# Altium schematic sheet PowerMonitor.SchDoc
size Letter; SheetNumber: 5; SheetTotal: 5
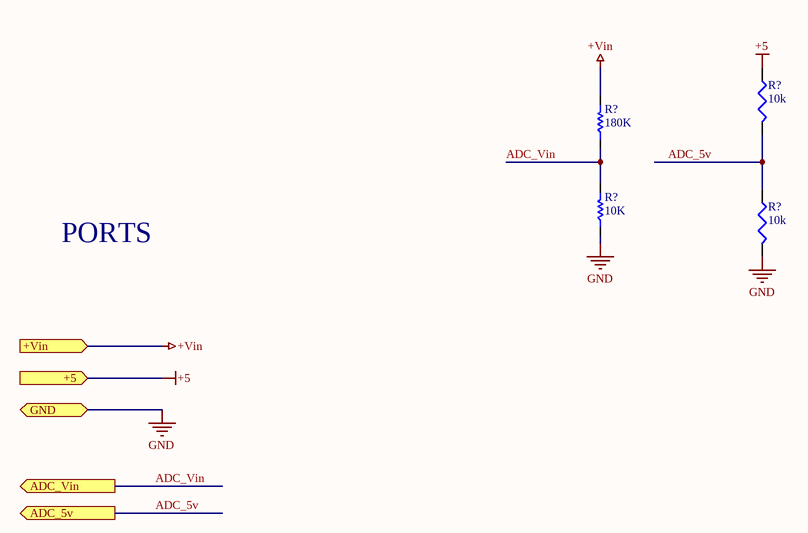
[diagram p0: PowerMonitor.SchDoc]

## Parts
(Parts that share a designator on the sheet are numbered #1, #2 ... from top to bottom, then left to right.)
R?#1  value 10k  [J1-0603]  (hidden comment: RC0603FR-0710KL)
R?#2  180K  [RES 0603 (1608X06L)]
R?#3  value 10k  [J1-0603]  (hidden comment: RC0603FR-0710KL)
R?#4  10K  [RES 0603 (1608X06L)]

## Ports
+5 (in), +Vin (in), ADC_5v (out), ADC_Vin (out), GND (bidir)

## Nets
+5: R?#1.1 ; port +5
+Vin: R?#2.2 ; port +Vin
GND: R?#3.2 R?#4.1 ; port GND
ADC_5v: R?#1.2 R?#3.1 ; port ADC_5v
ADC_Vin: R?#2.1 R?#4.2 ; port ADC_Vin

## Notes on the sheet
- PORTS

## Library data of the parts
R?#1 R?#3 = RC0603FR-0710KL: 10 kOhms 1 0.1 W 1 10 W Chip Resistor 0603 1608 Metric Thick Film; Pacage Metric: 1608; MF: Yageo or NXP; MP: 10K 1% 0603; ChipDip_Link: https://www.chipdip.ru/product0/9000079736; HelpURL: https://www.chipdip.ru/product0/9000079736; Package: R0603; Type: SMD; SnapEDA_Link: https://www.snapeda.com/parts/RC0603FR-0710KL/Yageo/view-part/?ref=dk&t=RC0603FR-0710KL&con_ref=None
R?#2 R?#4 = Resistor: Tolerance: 5%; Power: 1/8 W
  R?#2: Value: 180K
  R?#4: Value: 10K